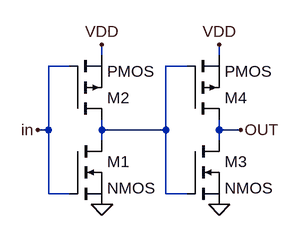
[diagram p0: schematic BUFFER.asc]
BUFFER.asc, the LTspice schematic file:
Version 4
SHEET 1 1112 680
WIRE 128 80 128 64
WIRE 304 80 304 64
WIRE 80 96 48 96
WIRE 256 96 224 96
WIRE 48 192 48 96
WIRE 48 192 32 192
WIRE 128 192 128 176
WIRE 224 192 224 96
WIRE 224 192 128 192
WIRE 304 192 304 176
WIRE 336 192 304 192
WIRE 128 208 128 192
WIRE 304 208 304 192
WIRE 48 288 48 192
WIRE 80 288 48 288
WIRE 224 288 224 192
WIRE 256 288 224 288
FLAG 128 304 0
FLAG 32 192 in
FLAG 128 64 VDD
FLAG 304 304 0
FLAG 304 64 VDD
FLAG 336 192 OUT
SYMBOL nmos 80 208 R0
SYMATTR InstName M1
SYMBOL pmos 80 176 M180
SYMATTR InstName M2
SYMBOL nmos 256 208 R0
SYMATTR InstName M3
SYMBOL pmos 256 176 M180
SYMATTR InstName M4

The netlist it stands for:
* BUFFER.asc
M1 N001 in 0 0 NMOS
M2 N001 in VDD VDD PMOS
M3 OUT N001 0 0 NMOS
M4 OUT N001 VDD VDD PMOS
.model NMOS NMOS
.model PMOS PMOS
.lib standard.mos
.backanno
.end